# Altium schematic sheet grbl-board.SchDoc
size A3
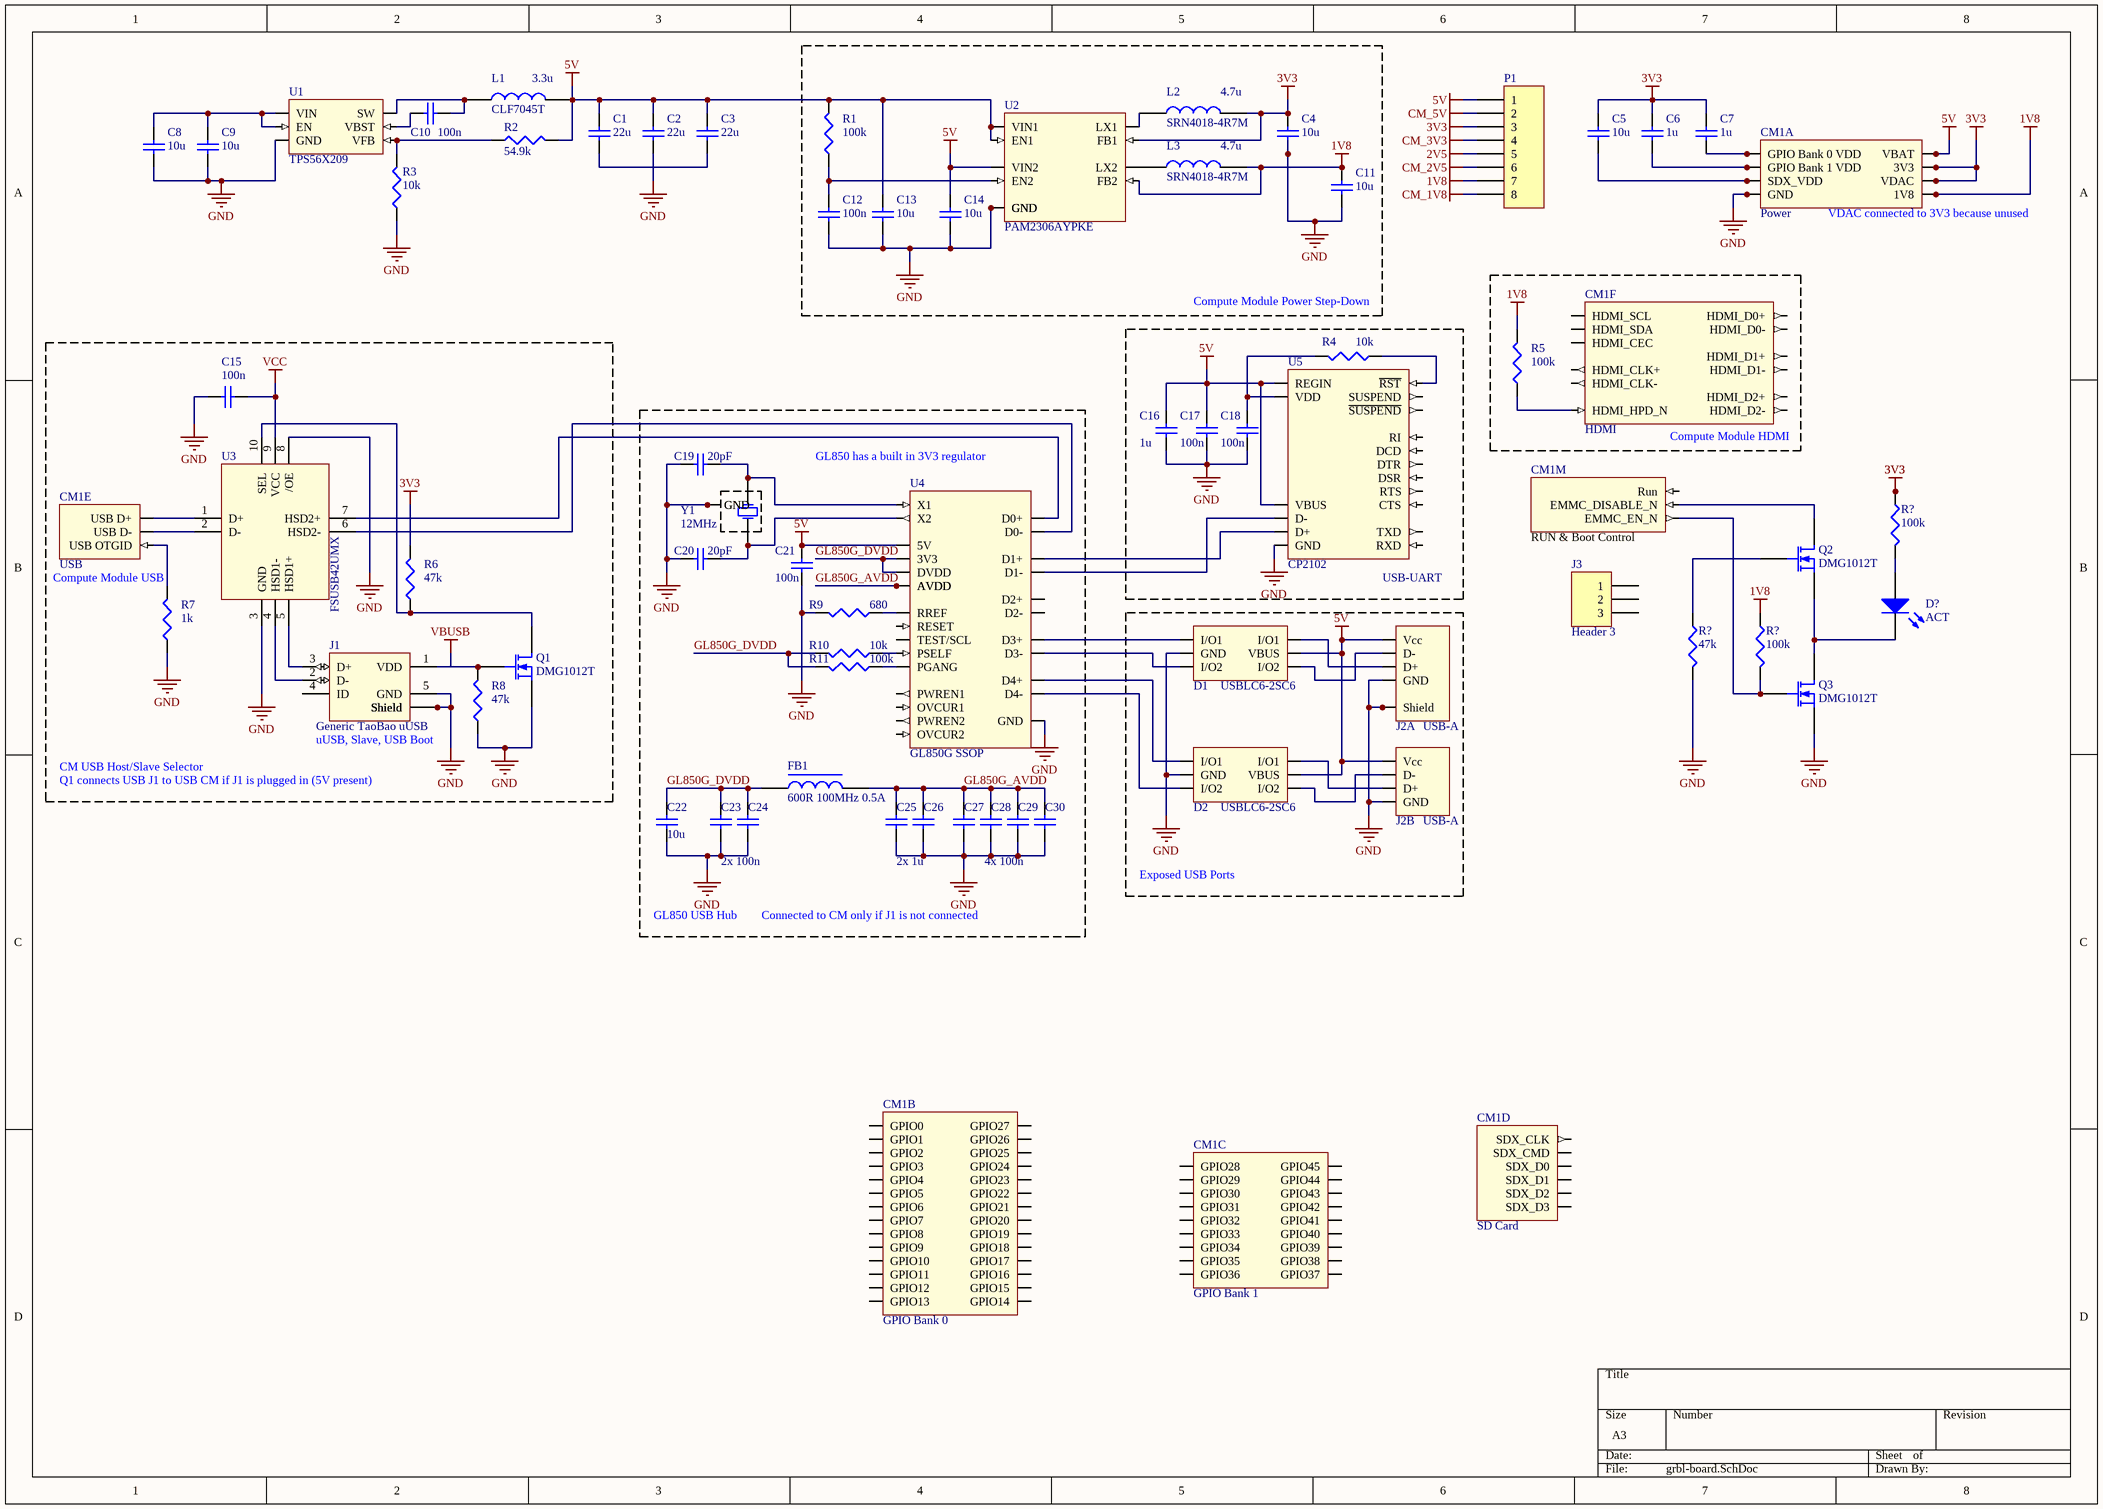
[diagram p0: grbl-board.SchDoc]

## Parts
(Parts that share a designator on the sheet are numbered #1, #2 ... from top to bottom, then left to right.)
C1  value 22u  [1608[0603]]  (hidden comment: Cap Semi)
C2  value 22u  [1608[0603]]  (hidden comment: Cap Semi)
C3  value 22u  [1608[0603]]  (hidden comment: Cap Semi)
C4  value 10u  [C0805]  (hidden comment: Cap Semi)
C5  value 10u  [C0805]  (hidden comment: Cap Semi)
C6  value 1u  [1608[0603]]  (hidden comment: Cap Semi)
C7  value 1u  [1608[0603]]  (hidden comment: Cap Semi)
C8  value 10u  [C0805]  (hidden comment: Cap Semi)
C9  value 10u  [C0805]  (hidden comment: Cap Semi)
C10  value 100n  [0603]  (hidden comment: Cap Semi)
C11  value 10u  [C0805]  (hidden comment: Cap Semi)
C12  value 100n  [0603]  (hidden comment: Cap Semi)
C13  value 10u  [C0805]  (hidden comment: Cap Semi)
C14  value 10u  [C0805]  (hidden comment: Cap Semi)
C15  value 100n  [0603]  (hidden comment: Cap Semi)
C16  value 1u  [1608[0603]]  (hidden comment: Cap Semi)
C17  value 100n  [0603]  (hidden comment: Cap Semi)
C18  value 100n  [0603]  (hidden comment: Cap Semi)
C19  value 20pF  [C0805]  (hidden comment: Cap Semi)
C20  value 20pF  [C0805]  (hidden comment: Cap Semi)
C21  value 100n  [0603]  (hidden comment: Cap Semi)
C22  value 10u  [C0805]  (hidden comment: Cap Semi)
C23  value 2x 100n  [0603]  (hidden comment: Cap Semi)
C24  Cap Semi  [0603]  (value not drawn)
C25  value 2x 1u  [1608[0603]]  (hidden comment: Cap Semi)
C26  Cap Semi  [1608[0603]]  (value not drawn)
C27  value 4x 100n  [0603]  (hidden comment: Cap Semi)
C28  Cap Semi  [0603]  (value not drawn)
C29  Cap Semi  [0603]  (value not drawn)
C30  Cap Semi  [0603]  (value not drawn)
CM1  Compute Module  [1473005-4]  (value not drawn)  (parts A,B,C,D,E,F,M of 13)
D1  USBLC6-2SC6  [SOT23-6L]
D2  USBLC6-2SC6  [SOT23-6L]
D?  ACT  [3.2X1.6X1.1]
FB1  600R 100MHz 0.5A  [1608[0603]]
J1  Generic TaoBao uUSB  [generic TH microusb]
J2  USB-A  [generic stacked USB A]  (parts A,B of 2)
J3  Header 3  [HDR1X3]
L1  CLF7045T  value 3.3u  [CLF7045T]
L2  SRN4018-4R7M  value 4.7u  [SRN4018]
L3  SRN4018-4R7M  value 4.7u  [SRN4018]
P1  Header 8  [HDR1X8]  (value not drawn)
Q1  DMG1012T  [SOT50P160X80-3N]
Q2  DMG1012T  [SOT50P160X80-3N]
Q3  DMG1012T  [SOT50P160X80-3N]
R1  value 100k  [J1-0603]  (hidden comment: Res3)
R2  value 54.9k  [J1-0603]  (hidden comment: Res3)
R3  value 10k  [J1-0603]  (hidden comment: Res3)
R4  value 10k  [J1-0603]  (hidden comment: Res3)
R5  value 100k  [J1-0603]  (hidden comment: Res3)
R6  value 47k  [J1-0603]  (hidden comment: Res3)
R7  value 1k  [J1-0603]  (hidden comment: Res3)
R8  value 47k  [J1-0603]  (hidden comment: Res3)
R9  value 680  [J1-0603]  (hidden comment: Res3)
R10  value 10k  [J1-0603]  (hidden comment: Res3)
R11  value 100k  [J1-0603]  (hidden comment: Res3)
R?#1  value 100k  [J1-0603]  (hidden comment: Res3)
R?#2  value 47k  [J1-0603]  (hidden comment: Res3)
R?#3  value 100k  [J1-0603]  (hidden comment: Res3)
U1  TPS56X209  [SOP6]
U2  PAM2306AYPKE  [WDFN-12]
U3  FSUSB42UMX  [QFN40P140X180X55-10N]
U4  GL850G SSOP  [SOP28]
U5  CP2102  [QFN-28]
Y1  12MHz  [3225]

## Blocks framed on the sheet
Compute Module Power Step-Down: C4 C11-C14 L2 L3 R1 U2
Compute Module HDMI: CM1 R5
USB-UART: C16-C18 R4 U5
Exposed USB Ports: D1 D2 J2

## Nets
1V8: C11.2 CM1.183(1V8) CM1.184(1V8) CM1.185(1V8) CM1.186(1V8) L3.2 P1.7 R5.2 R?#3.1 U2.10(FB2)
2V5: P1.5
3V3: C4.2 C5.2 C6.2 C7.2 CM1.189(VDAC) CM1.190(VDAC) CM1.191(3V3) CM1.192(3V3) CM1.193(3V3) CM1.194(3V3) L2.2 P1.3 R6.2 R?#1.1 U2.4(FB1)
5V: C1.2 C2.2 C3.2 C13.2 C14.2 C16.1 C17.1 C21.1 CM1.197(VBAT) CM1.198(VBAT) CM1.199(VBAT) CM1.200(VBAT) D1.5(VBUS) D2.5(VBUS) J2.1(Vcc) J2.5(Vcc) L1.2 P1.1 R1.2 R2.2 U2.1(VIN2) U2.6(EN1) U2.7(VIN1) U4.23(5V) U5.7(REGIN) U5.8(VBUS)
CM_1V8: P1.8
CM_2V5: P1.6
CM_3V3: P1.4
CM_5V: P1.2
GND: C2.1 C4.1 C8.1 C9.1 C11.1 C12.1 C13.1 C14.1 C15.2 C16.2 C17.2 C18.2 C19.1 C20.1 C21.2 C22.1 C23.2 C24.2 C25.1 C26.1 C27.2 C28.2 C29.2 C30.2 CM1.1(GND) CM1.7(GND) CM1.8(GND) CM1.13(GND) CM1.14(GND) CM1.19(GND) CM1.20(GND) CM1.25(GND) CM1.26(GND) CM1.31(GND) CM1.32(GND) CM1.37(GND) CM1.38(GND) CM1.43(GND) CM1.44(GND) CM1.49(GND) CM1.50(GND) CM1.55(GND) CM1.56(GND) CM1.61(GND) CM1.62(GND) CM1.67(GND) CM1.68(GND) CM1.73(GND) CM1.74(GND) CM1.79(GND) CM1.80(GND) CM1.85(GND) CM1.86(GND) CM1.91(GND) CM1.92(GND) CM1.97(GND) CM1.98(GND) CM1.103(GND) CM1.104(GND) CM1.109(GND) CM1.110(GND) CM1.115(GND) CM1.116(GND) CM1.121(GND) CM1.122(GND) CM1.127(GND) CM1.133(GND) CM1.134(GND) CM1.139(GND) CM1.140(GND) CM1.145(GND) CM1.146(GND) CM1.151(GND) CM1.152(GND) CM1.157(GND) CM1.163(GND) CM1.164(GND) CM1.169(GND) CM1.170(GND) CM1.181(GND) CM1.182(GND) CM1.187(GND) CM1.188(GND) CM1.195(GND) CM1.196(GND) D1.2(GND) D2.2(GND) J1.5(GND) J1.6(Shield) J1.7(Shield) J1.8(Shield) J1.9(Shield) J2.4(GND) J2.8(GND) J2.9(Shield) J2.10(Shield) J2.11(Shield) J2.12(Shield) Q1.2(S) Q3.2(S) R3.1 R7.1 R8.1 R9.2 R?#2.2 U1.1(GND) U2.3(GND) U2.9(GND) U2.PAD(GND) U3.3(GND) U3.8(/OE) U4.15(GND) U5.3(GND) Y1.2(GND) Y1.4(GND)
VBUSB: J1.1(VDD) Q1.1(G) R8.2
VCC: C15.1 U3.9(VCC)
GL850G_AVDD: C25.2 C26.2 C27.1 C28.1 C29.1 C30.1 FB1.2 U4.1(AVDD) U4.5(AVDD) U4.10(AVDD)
GL850G_DVDD: C22.2 C23.1 C24.1 FB1.1 R10.2 R11.2 U4.16(DVDD) U4.24(3V3)
NetC1_1: C1.1 C3.1
NetC5_1: C5.1 CM1.4(SDX_VDD) CM1.6(SDX_VDD)
NetC6_1: C6.1 CM1.41(GPIO_Bank_1_VDD) CM1.42(GPIO_Bank_1_VDD)
NetC7_1: C7.1 CM1.39(GPIO_Bank_0_VDD) CM1.40(GPIO_Bank_0_VDD)
NetC8_2: C8.2 C9.2 U1.3(VIN) U1.5(EN)
NetC10_1: C10.1 L1.1 U1.2(SW)
NetC10_2: C10.2 U1.6(VBST)
NetC12_2: C12.2 R1.1 U2.12(EN2)
NetC18_1: C18.1 R4.2 U5.6(VDD)
NetC19_2: C19.2 U4.6(X1) Y1.1(OSC1)
NetC20_2: C20.2 U4.7(X2) Y1.3(OSC2)
NetCM1_2: CM1.2(EMMC_DISABLE_N) Q2.3(D)
NetCM1_88: CM1.88(HDMI_HPD_N) R5.1
NetCM1_90: CM1.90(EMMC_EN_N) Q3.1(G) R?#3.2
NetCM1_165: CM1.165(USB_D+) U3.1(D+)
NetCM1_167: CM1.167(USB_D-) U3.2(D-)
NetCM1_168: CM1.168(USB_OTGID) R7.2
NetD1_1: D1.1(I/O1) U4.9(D3+)
NetD1_3: D1.3(I/O2) U4.8(D3-)
NetD1_3: D1.3(I/O1) J2.3(D+)  [a separate net that carries the same name]
NetD1_4: D1.4(I/O2) J2.2(D-)
NetD2_1: D2.1(I/O1) U4.12(D4+)
NetD2_3: D2.3(I/O2) U4.11(D4-)
NetD2_3: D2.3(I/O1) J2.7(D+)  [a separate net that carries the same name]
NetD2_4: D2.4(I/O2) J2.6(D-)
NetD?_1: D?.1(A) R?#1.2
NetD?_2: D?.2(K) Q2.2(S) Q3.3(D)
NetJ1_2: J1.2(D-) U3.4(HSD1-)
NetJ1_3: J1.3(D+) U3.5(HSD1+)
NetL2_1: L2.1 U2.8(LX1)
NetL3_1: L3.1 U2.2(LX2)
NetQ1_3: Q1.3(D) R6.1 U3.10(SEL)
NetQ2_1: Q2.1(G) R?#2.1
NetR2_1: R2.1 R3.2 U1.4(VFB)
NetR4_1: R4.1 U5.9(~{RST})
NetR9_1: R9.1 U4.4(RREF)
NetR10_1: R10.1 U4.17(PSELF)
NetR11_1: R11.1 U4.18(PGANG)
NetU3_6: U3.6(HSD2-) U4.25(D0-)
NetU3_7: U3.7(HSD2+) U4.26(D0+)
NetU4_27: U4.27(D1-) U5.5(D-)
NetU4_28: U4.28(D1+) U5.4(D+)

Not connected (* = marked no-connect by the designer): CM1 3(GPIO0) 5(GPIO1) 9(GPIO2) 10(SDX_CLK) 11(GPIO3) 12(SDX_CMD) 15(GPIO4) 16(SDX_D0) 17(GPIO5) 18(SDX_D1) 21(GPIO6) 22(SDX_D2) 23(GPIO7) 24(SDX_D3) 27(GPIO8) 28(GPIO28) 29(GPIO9) 30(GPIO29) 33(GPIO10) 34(GPIO30) 35(GPIO11) 36(GPIO31) 45(GPIO12) 46(GPIO32) 47(GPIO13) 48(GPIO33) 51(GPIO14) 52(GPIO34) 53(GPIO15) 54(GPIO35) 57(GPIO16) 58(GPIO36) 59(GPIO17) 60(GPIO37) 63(GPIO18) 64(GPIO38) 65(GPIO19) 66(GPIO39) 69(GPIO20) 70(GPIO40) 71(GPIO21) 72(GPIO41) 75(GPIO22) 76(GPIO42) 77(GPIO23) 78(GPIO43) 81(GPIO24) 82(GPIO44) 83(GPIO25) 84(GPIO45) 87(GPIO26) 89(GPIO27) 111(HDMI_CLK-) 113(HDMI_CLK+) 117(HDMI_D0-) 119(HDMI_D0+) 123(HDMI_D1-) 125(HDMI_D1+) 129(HDMI_D2-) 131(HDMI_D2+) 171(HDMI_CEC) 173(HDMI_SDA) 175(HDMI_SCL) 177(Run); J1 4(ID); J3 1 2 3; U4 2(D2-) 3(D2+) 13(RESET) 14(TEST/SCL) 19(OVCUR2) 20(PWREN2) 21(OVCUR1) 22(PWREN1); U5 1(DCD) 2(RI) 11(~{SUSPEND}) 12(SUSPEND) 23(CTS) 24(RTS) 25(RXD) 26(TXD) 27(DSR) 28(DTR)

## Notes on the sheet
- (near CM1) VDAC connected to 3V3 because unused
- (near U4) GL850 has a built in 3V3 regulator
- (near R7) Compute Module USB
- Q1 connects USB J1 to USB CM if J1 is plugged in (5V present)
- CM USB Host/Slave Selector
- uUSB, Slave, USB Boot
- GL850 USB Hub
- Connected to CM only if J1 is not connected
- (in symbol Compute Module, part A) Power
- (in symbol Compute Module, part B) GPIO Bank 0
- (in symbol Compute Module, part C) GPIO Bank 1
- (in symbol Compute Module, part D) SD Card
- (in symbol Compute Module, part E) USB
- (in symbol Compute Module, part F) HDMI
- (in symbol Compute Module, part M) RUN & Boot Control

## Library data of the parts
C1-C3 = Cap Semi: Capacitor (Semiconductor SIM Model); RS: 915-9114; Published: 8-Jun-2000; LatestRevisionDate: 29-May-2009; LatestRevisionNote: IPC-7351 Footprint Added.; PackageReference: C1206; Publisher: Altium Limited; PackageDescription: Chip Capacitor
C4 C5 C8 C9 C11 C13 C14 C22 = Cap Semi: Capacitor (Semiconductor SIM Model); RS: 885-1758; Published: 8-Jun-2000; LatestRevisionDate: 29-May-2009; LatestRevisionNote: IPC-7351 Footprint Added.; PackageReference: C1206; Publisher: Altium Limited; PackageDescription: Chip Capacitor
C6 C7 C16 C25 = Cap Semi: Capacitor (Semiconductor SIM Model); RS: 8847172; Published: 8-Jun-2000; LatestRevisionDate: 29-May-2009; LatestRevisionNote: IPC-7351 Footprint Added.; PackageReference: C1206; Publisher: Altium Limited; PackageDescription: Chip Capacitor
C10 C12 C15 C17 C18 C21 C23 C27 = Cap Semi: Capacitor (Semiconductor SIM Model); RS: 113-8716; Published: 8-Jun-2000; LatestRevisionDate: 29-May-2009; LatestRevisionNote: IPC-7351 Footprint Added.; PackageReference: C1206; Publisher: Altium Limited; PackageDescription: Chip Capacitor
C19 C20 = Cap Semi: Capacitor (Semiconductor SIM Model); Published: 8-Jun-2000; LatestRevisionDate: 29-May-2009; LatestRevisionNote: IPC-7351 Footprint Added.; PackageReference: C1206; Publisher: Altium Limited; PackageDescription: Chip Capacitor
C24 C28-C30 = Cap Semi: Capacitor (Semiconductor SIM Model); Value: 100n; RS: 113-8716; Published: 8-Jun-2000; LatestRevisionDate: 29-May-2009; LatestRevisionNote: IPC-7351 Footprint Added.; PackageReference: C1206; Publisher: Altium Limited; PackageDescription: Chip Capacitor
C26 = Cap Semi: Capacitor (Semiconductor SIM Model); Value: 1u; RS: 8847172; Published: 8-Jun-2000; LatestRevisionDate: 29-May-2009; LatestRevisionNote: IPC-7351 Footprint Added.; PackageReference: C1206; Publisher: Altium Limited; PackageDescription: Chip Capacitor
CM1 = Compute Module: Raspberry Pi Compute Module
D1 D2 = USBLC6-2SC6: STMicroelectronics USBLC6-2SC6, Dual Uni-Directional TVS Diode Array, 6-Pin SOT-23
D? = LED2: Typical RED, GREEN, YELLOW, AMBER GaAs LED; Published: 8-Jun-2000; LatestRevisionDate: 17-Jul-2002; LatestRevisionNote: Re-released for DXP Platform.; PackageVersion: Feb-2002; PackageReference: 3.2X1.6X1.1; Publisher: Altium Limited; PackageDescription: SM LED; 2 Flat Leads
FB1 = BLM18AG601SN1D: Murata Ferrite Bead 600Ω impedance at 100 MHz; RS: 724-1299
J1 = 编带 迈克牛角 micro usb 5pin 5针: https://detail.tmall.com/item.htm?id=41230755573
J2 = 双层USB母座90度弯针: https://detail.tmall.com/item.htm?id=41230755573
J3 = Header 3: Header, 3-Pin; LatestRevisionDate: 17-Jul-2002; LatestRevisionNote: Re-released for DXP Platform.; Publisher: Altium Limited
L1 = CLF7045T: Shielded Wire-wound SMD Inductor with a Ferrite Core, 3.3 μH ±30% Wire-Wound 5A Idc; Manufacturer_Name: Bourns; Manufacturer_Part_Number: SRN4018-4R7M; Geometry.Height: mm; Supplier_Name: RS; RS Part Number: 792-4010; Allied_Number: *; Other Part Number: *; Datasheet Link: https://componentsearchengine.com/Datasheets/2/SRN4018-4R7M.pdf; 3D Package: *
L2 L3 = SRN4018-4R7M: Inductor SMD 4x4 semi-shielded 4,7uH Bourns SRN4018 Series Shielded Wire-wound SMD Inductor with a Ferrite Core, 4.7 H 20% Wire-Wound 1.9A rms Idc; Geometry.Height: mm; Supplier_Name: RS; RS Part Number: 7729714; Manufacturer_Name: Bourns; Manufacturer_Part_Number: SRN4018-4R7M; Allied_Number: *; Other Part Number: *; Datasheet Link: https://componentsearchengine.com/Datasheets/2/SRN4018-4R7M.pdf; 3D Package: *
P1 = Header 8: Header, 8-Pin; LatestRevisionDate: 17-Jul-2002; LatestRevisionNote: Re-released for DXP Platform.; Publisher: Altium Limited
Q1-Q3 = DMG1012T-7: MOSFET N-Channel 20V 0.63A SOT523 Diodes Inc DMG1012T-7 N-channel MOSFET Transistor, 0.63 A, 20 V, 3-Pin SOT-523; Manufacturer_Name: Diodes Inc.; Geometry.Height: 0.8mm; Supplier_Name: RS; RS Part Number: 7514064; Manufacturer_Part_Number: DMG1012T-7; Allied_Number: *; Other Part Number: *; Datasheet Link: https://www.diodes.com/assets/Datasheets/ds31783.pdf; 3D Package: *
R1 R3-R11 R?#1-R?#3 = Res3: Resistor; Published: 8-Jun-2000; LatestRevisionDate: 29-May-2009; LatestRevisionNote: IPC-7351 Footprint Added.; PackageReference: J1-0603; Publisher: Altium Limited; PackageDescription: Chip Resistor
R2 = Res3: Resistor; RS: 679-0538; Published: 8-Jun-2000; LatestRevisionDate: 29-May-2009; LatestRevisionNote: IPC-7351 Footprint Added.; PackageReference: J1-0603; Publisher: Altium Limited; PackageDescription: Chip Resistor
U1 = TPS56X209: 4.5V to 17 V Input, 2-A, 3-A Synchronous Step-Down Voltage Regulator
U2 = PAM2306
U3 = FSUSB42UMX: IC, Fairchild, FSUSB42UMX Fairchild Semiconductor FSUSB42UMX, Analogue Switch Single DPDT 480Mbit/s, 3  4.4 V, 10-Pin UMLP; Geometry.Height: 0.55mm; Supplier_Name: RS; RS Part Number: 8076092; Manufacturer_Name: Fairchild Semiconductor; Manufacturer_Part_Number: FSUSB42UMX; Allied_Number: *; Other Part Number: *; Datasheet Link: https://www.fairchildsemi.com/datasheets/FS/FSUSB42.pdf; 3D Package: *
U4 = GL850G_SSOP
Y1 = XTAL: Crystal Oscillator; Published: 8-Jun-2000; LatestRevisionDate: 17-Jul-2002; LatestRevisionNote: Re-released for DXP Platform.; PackageReference: R38; Publisher: Altium Limited; PackageDescription: Crystal, Thru-Hole; 2 Leads; Body 3.1 x 8.2 mm (Dia.xH)